# EasyEDA schematic Scematich PCB.json
TITLE: Sheet_1; REV: 1.0; Date: 2025-09-29; Sheet: 1/1; Drawn By: akunnw97; Company: Your Company
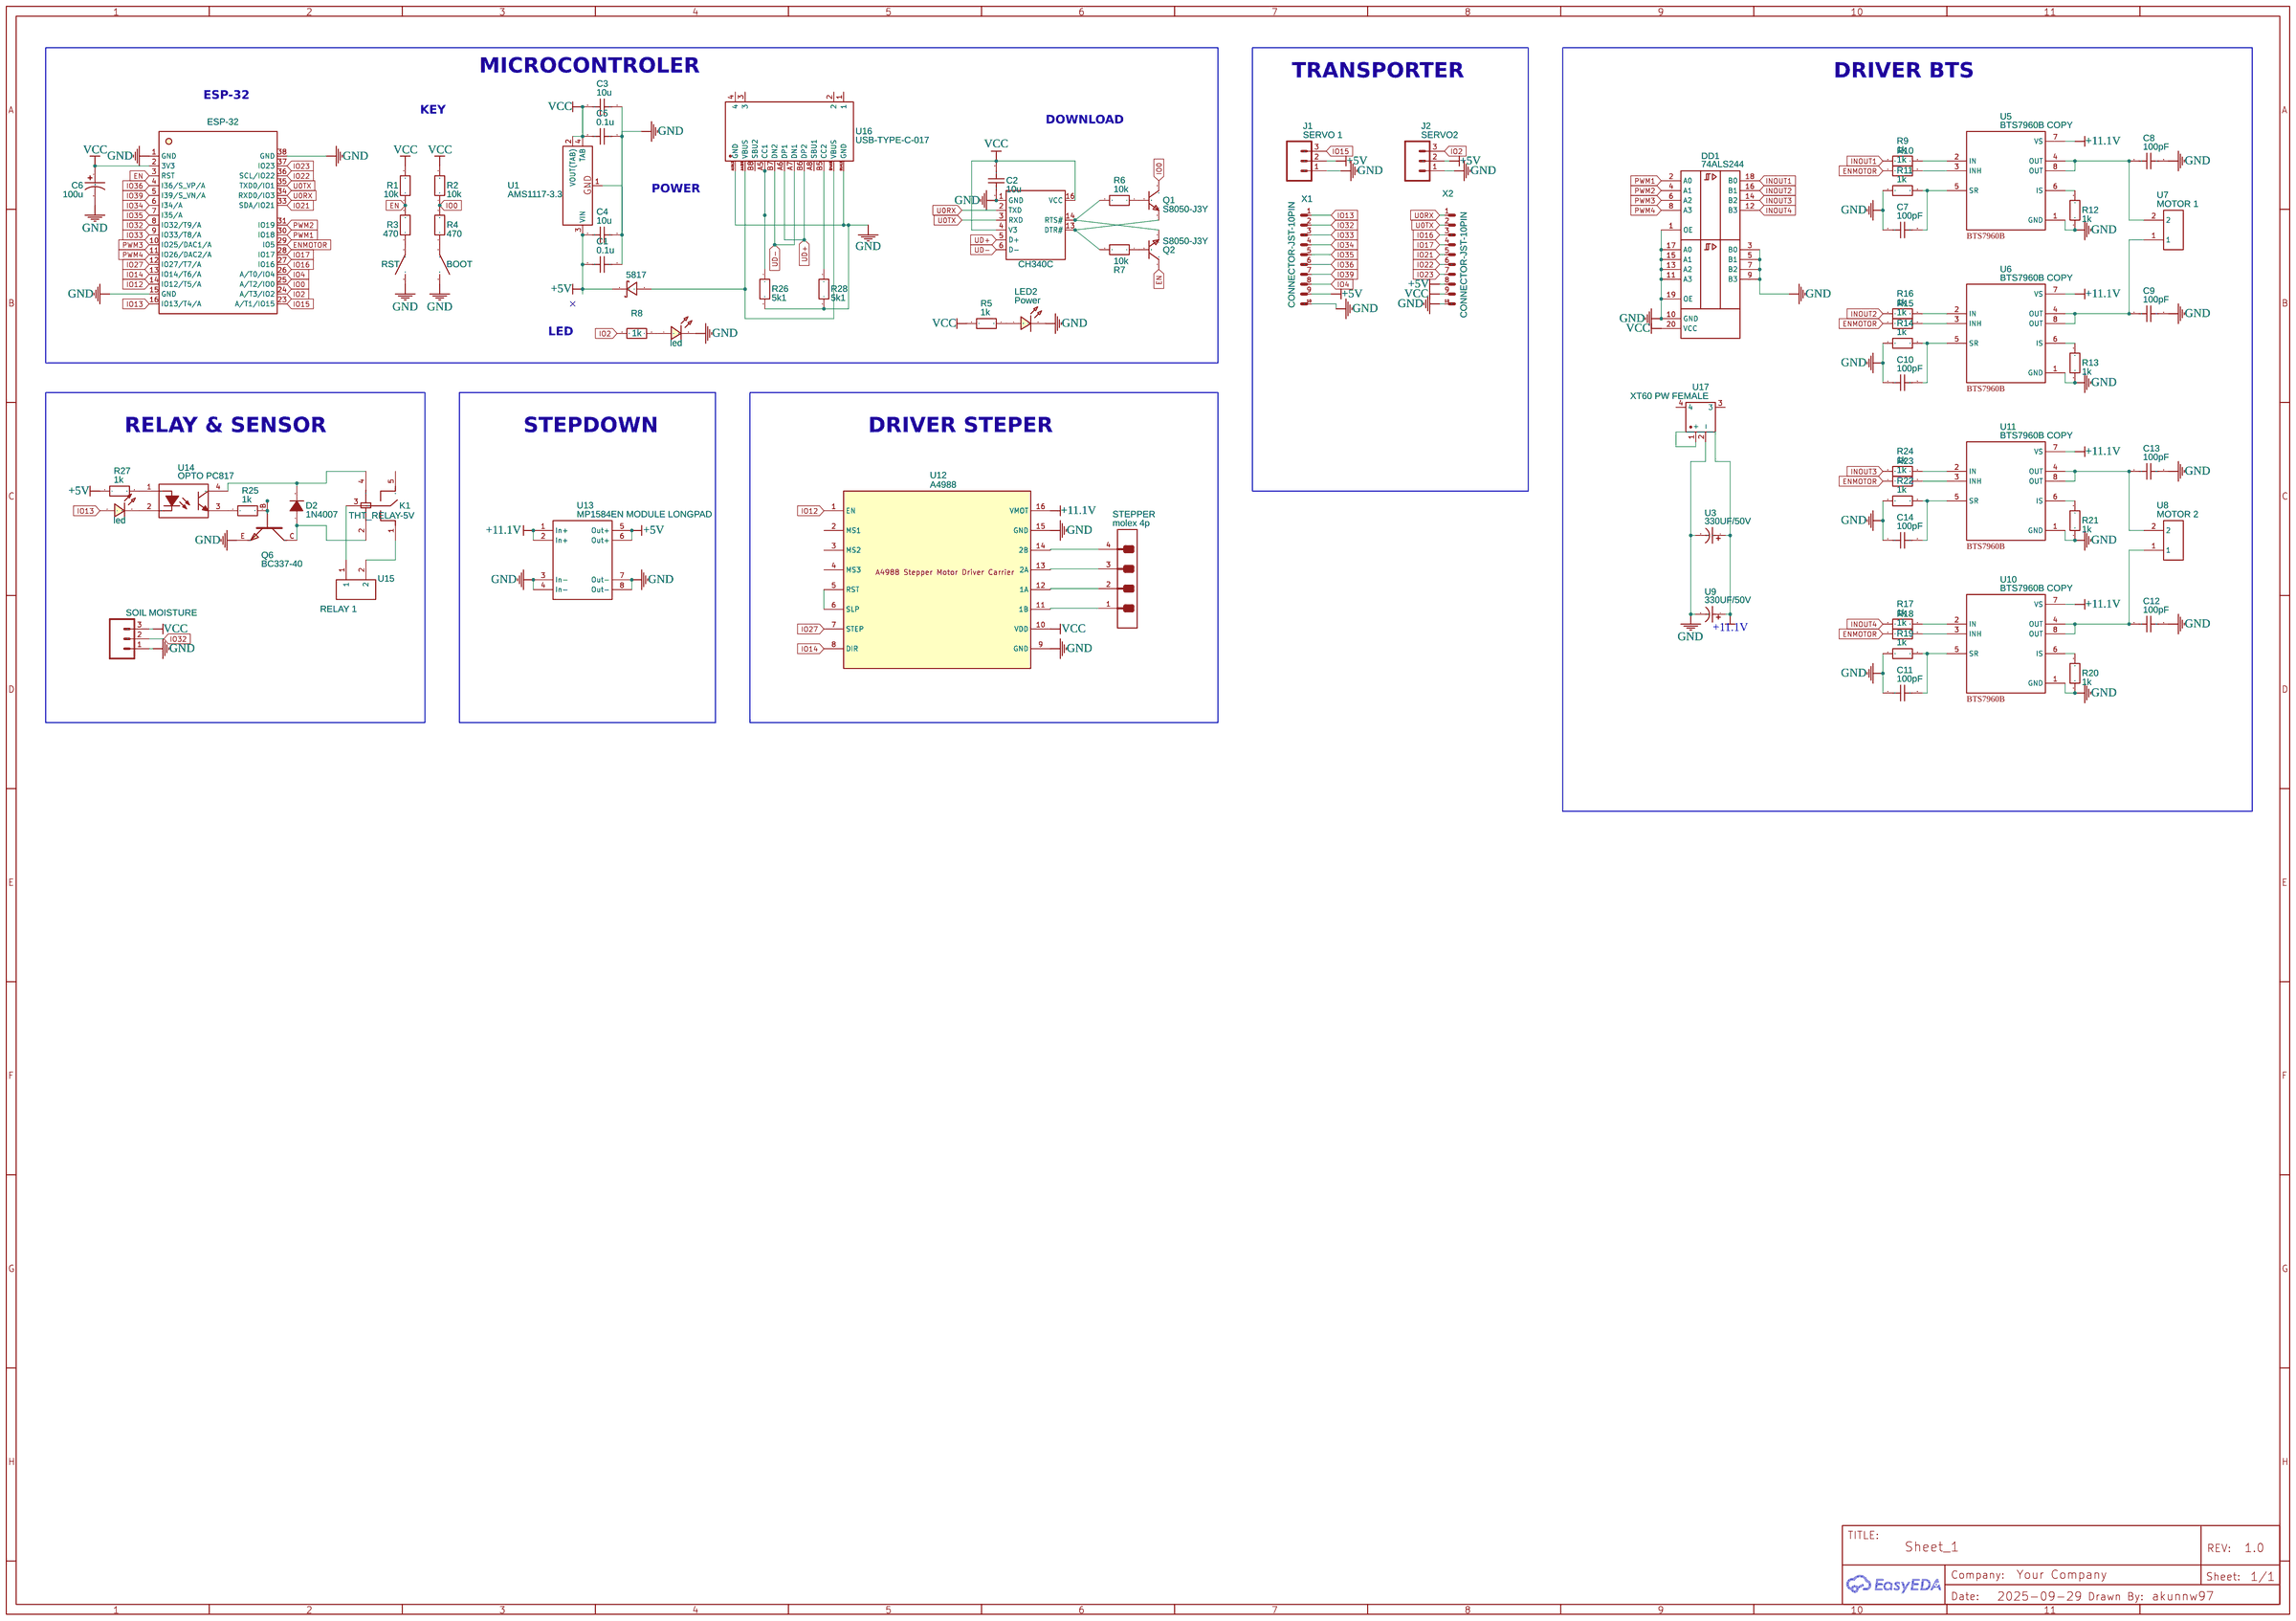
[diagram p0: schematic sheet]

## Parts
C1  0.1u  [C0805]
C2  10u  [C0805]
C3  10u  [C0805]
C4  10u  [C0805]
C5  0.1u  [C0805]
C6  100u  [CASE-B_3528]
C7  100pF  [C0805]
C8  100pF  [C0805]
C9  100pF  [C0805]
C10  100pF  [C0805]
C11  100pF  [C0805]
C12  100pF  [C0805]
C13  100pF  [C0805]
C14  100pF  [C0805]
D1  5817  [SOD-123F_L2.8-W1.8-LS3.7-RD]
D2  1N4007  [1N4007]
DD1  74ALS244  [SOIC-20_L13.0-W7.6-P1.27-LS10.3-BL]
J1  SERVO 1  [MOLEX-1X3]
J2  SERVO2  [MOLEX-1X3]
J4  SOIL MOISTURE  [MOLEX-1X3]
K1  THT_RELAY-5V  [RELAY-TH_RELAY-SPST]
LED1  led  [LED0805_RED]
LED2  Power  [LED0805_RED]
LED3  led  [LED0805_RED]
Q1  S8050-J3Y  [SOT-23-3_L3.0-W1.7-P0.95-LS2.9-BR]
Q2  S8050-J3Y  [SOT-23-3_L3.0-W1.7-P0.95-LS2.9-BR]
Q6  BC337-40  [BC337-40]
R1  10k  [R0805]
R2  10k  [R0805]
R3  470  [R0805]
R4  470  [R0805]
R5  1k  [R0805]
R6  10k  [R0805]
R7  10k  [R0805]
R8  1k  [R0805]
R9  1k  [R0805]
R10  1k  [R0805]
R11  1k  [R0805]
R12  1k  [R0805]
R13  1k  [R0805]
R14  1k  [R0805]
R15  1k  [R0805]
R16  1k  [R0805]
R17  1k  [R0805]
R18  1k  [R0805]
R19  1k  [R0805]
R20  1k  [R0805]
R21  1k  [R0805]
R22  1k  [R0805]
R23  1k  [R0805]
R24  1k  [R0805]
R25  1k  [R0805]
R26  5k1  [R0805]
R27  1k  [R0805]
R28  5k1  [R0805]
STEPPER  molex 4p  [MOLEX---47053-1000_MOLEX]
SW1  RST  [SW-SMD_L4.0-W2.9-LS5.0-A]
SW2  BOOT  [SW-SMD_L4.0-W2.9-LS5.0-A]
U1  AMS1117-3.3  [SOT-223_L6.7-W3.5-P2.30-BR]
U2  CH340C  [CH340C]
U3  330UF/50V  [330UF/50V]
U4  ESP-32  [ESP-32]
U5  BTS7960B COPY  [BTS7960B]
U6  BTS7960B COPY  [BTS7960B]
U7  MOTOR 1  [TERMINAL BLOK 2P]
U8  MOTOR 2  [TERMINAL BLOK 2P]
U9  330UF/50V  [330UF/50V]
U10  BTS7960B COPY  [BTS7960B]
U11  BTS7960B COPY  [BTS7960B]
U12  A4988  [A4988]
U13  MP1584EN MODULE LONGPAD  [MP1584EN-MODULE]
U14  OPTO PC817  [PC817B]
U15  RELAY 1  [TERMINAL BLOK 2P]
U16  USB-TYPE-C-017  [USB-TYPE-C-SMD_TYPE-C-SMT-16P]
U17  XT60 PW FEMALE  [XT60 PW FEMALE]
X1  CONNECTOR-JST-10PIN  [JST-XH-10PIN-LONG-PAD]
X2  CONNECTOR-JST-10PIN  [JST-XH-10PIN-LONG-PAD]

## Library data of the parts
C1-C5 C7-C14 = C_0603_US: Contributor: LCEDA_Lib
C6 = C_Tan_SMD_B_US: Contributor: LCEDA_Lib
D1 = 1N5819W: Supplier: LCSC; Supplier Part: C169540; Manufacturer: Shandong Jingdao Microelectronics; Contributor: LCSC; LCSC Assembly: Yes; SMT Type: Extend
D2 = 1N4007: Supplier: LCSC; Manufacturer: SEMTECH; Supplier Part: C106903; Contributor: inspireindia institute
DD1 = 74ALS244: Contributor: microdrv
J1 J2 J4 = CONN_03POLAR: Contributor: bartleph
K1 = THT_RELAY-SPST_5V: Supplier: LCSC; Supplier Part: C2941249; Manufacturer: null; Manufacturer Part: Relay-SPST; JLCPCB Part Class: Extended Part; Contributor: amiramsyar222
LED1-LED3 = LED-0603_R: Manufacturer: EVERLIGHT(台湾亿光); Manufacturer Part: 19-217/R6C-AL1M2VY/3T; Supplier Part: C72044; Supplier: LCSC; Contributor: LCEDA_01
Q1 Q2 = S8050-J3Y: Supplier: LCSC; Supplier Part: C364312; Manufacturer: (MDD) Jiangsu Yutai Elec; Contributor: LCSC; JLCPCB Part Class: Extended Part
Q6 = BC817-40: Contributor: gokulpriya
R1-R28 = R_0603_EU: Contributor: LCEDA_Lib
STEPPER = molex 4p: Contributor: delil1220
SW1 SW2 = 龟仔按键-带柱: Supplier: LCSC; Supplier Part: C354947; Manufacturer: BRIGHT; Manufacturer Part: TSA343G00D-250J2; Contributor: Fangbrbr
U1 = AMS1117-3.3: Supplier: LCSC; Supplier Part: C347222; Manufacturer: Youtai Semiconductor Co., Ltd.; Contributor: Fangbrbr; SMT Type: Extend; JLCPCB SMD: Yes
U2 = CH340C: Supplier: LCSC; Manufacturer: WCH; Supplier Part: C84681; Paste Type: recommend; Contributor: Fangbrbr
U3 U9 = 330UF/50V: Contributor: bangelektro123
U4 = 安信可ESP-32S: Supplier: LCSC; Supplier Part: C82899; Manufacturer: Ai-Thinker; Manufacturer Part: ESP-32S; Contributor: Fangbrbr
U5 U6 U10 U11 = BTS7960B COPY: Contributor: sakdnx
U7 U8 U15 = Terminal block 2p: Contributor: eril44
U12 = A4988: Contributor: ___________; sourceId: YsmgyP7pj
U13 = MP1584EN MODULE LONGPAD: Manufacturer Part: MP1584EN Module; Contributor: dardito2
U14 = PC817B: Contributor: xubaer
U16 = USB-TYPE-C-017: Supplier: LCSC; Supplier Part: C2927037; Manufacturer: DEALON(德艺隆); link: https://atta.szlcsc.com/upload/public/pdf/source/20211217/653222EE5174722C9DFE2966329956D8.pdf; JLCPCB Part Class: Extended Part; Contributor: icecycle
U17 = XT60 PW FEMALE: Manufacturer: Amass; Supplier: LCSC; Supplier Part: Amass; Contributor: s.shivr16
X1 X2 = CONNECTOR-JST-10PIN: Manufacturer: JST; Manufacturer Part: B2B-XH-AM(LF)(SN); Supplier: RS-Online; Supplier Part: 175-5596; Contributor: a20190798

## Nets
+5V: C1.2 C4.2 D1.1 J1.2 J2.2 R27.1 U1.3(VIN) U13.5(Out+) U13.6(Out+) X1.9 X2.8
+11.1V: U3.1 U5.7(VS) U6.7(VS) U9.1 U10.7(VS) U11.7(VS) U12.16(VMOT) U13.1(In+) U13.2(In+) U17.1(+)
GND: C1.1 C2.1 C3.1 C4.1 C5.1 C6.2 C7.1 C8.2 C9.2 C10.1 C11.1 C12.2 C13.2 C14.1 DD1.1(OE) DD1.3(B0) DD1.5(B1) DD1.7(B2) DD1.9(B3) DD1.10(GND) DD1.11(A3) DD1.13(A2) DD1.15(A1) DD1.17(A0) DD1.19(OE) J1.1 J2.1 J4.1 LED1.2 LED2.2 Q6.E R11.1 R12.1 R13.1 R14.1 R19.1 R20.1 R21.1 R22.1 R26.2 R28.2 SW1.2 SW2.2 U1.1(ADJ(GND)) U2.1(GND) U3.2 U4.1(GND) U4.15(GND) U4.38(GND) U5.1(GND) U6.1(GND) U9.2 U10.1(GND) U11.1(GND) U12.9(GND) U12.15(GND) U13.3(In-) U13.4(In-) U13.7(Out-) U13.8(Out-) U16.A1B12(GND) U16.B1A12(GND) U17.2(-) X1.10 X2.10
VCC: C2.2 C3.2 C5.2 C6.1 DD1.20(VCC) J4.3 R1.2 R2.2 R5.2 U1.2(VOUT(TAB)) U1.4(TAB) U2.4(V3) U2.16(VCC) U4.2(3V3) U12.10(VDD) X2.9
EN: Q2.3(C) R1.1 R3.2 U4.3(RST)
ENMOTOR: R10.1 R15.1 R18.1 R23.1 U4.29(IO5)
INOUT1: DD1.18(B0) R9.1
INOUT2: DD1.16(B1) R16.1
INOUT3: DD1.14(B2) R24.1
INOUT4: DD1.12(B3) R17.1
IO0: Q1.3(C) R2.1 R4.2 U4.25(A/T2/IO0)
IO2: J2.3 R8.2 U4.24(A/T3/IO2)
IO4: U4.26(A/T0/IO4) X1.8
IO12: U4.14(IO12/T5/A) U12.1(EN)
IO13: LED3.1 U4.16(IO13/T4/A) X1.1
IO14: U4.13(IO14/T6/A) U12.8(DIR)
IO15: J1.3 U4.23(A/T1/IO15)
IO16: U4.27(IO16) X2.3
IO17: U4.28(IO17) X2.4
IO21: U4.33(SDA/IO21) X2.5
IO22: U4.36(SCL/IO22) X2.6
IO23: U4.37(IO23) X2.7
IO27: U4.12(IO27/T7/A) U12.7(STEP)
IO32: J4.2 U4.8(IO32/T9/A) X1.2
IO33: U4.9(IO33/T8/A) X1.3
IO34: U4.6(I34/A) X1.4
IO35: U4.7(I35/A) X1.5
IO36: U4.4(I36/S_VP/A) X1.6
IO39: U4.5(I39/S_VN/A) X1.7
PWM1: DD1.2(A0) U4.30(IO18)
PWM2: DD1.4(A1) U4.31(IO19)
PWM3: DD1.6(A2) U4.10(IO25/DAC1/A)
PWM4: DD1.8(A3) U4.11(IO26/DAC2/A)
U0RX: U2.2(TXD) U4.34(RXD0/IO3) X2.1
U0TX: U2.3(RXD) U4.35(TXD0/IO1) X2.2
UD+: U2.5(D+) U16.A6(DP1) U16.B6(DP2)
UD-: U2.6(D-) U16.A7(DN1) U16.B7(DN2)
Net-(C7-2): C7.2 R11.2 U5.5(SR)
Net-(C8-1): C8.1 U5.4(OUT) U5.8(OUT) U7.2
Net-(C9-1): C9.1 U6.4(OUT) U6.8(OUT) U7.1
Net-(C10-2): C10.2 R14.2 U6.5(SR)
Net-(C11-2): C11.2 R19.2 U10.5(SR)
Net-(C12-1): C12.1 U8.1 U10.4(OUT) U10.8(OUT)
Net-(C13-1): C13.1 U8.2 U11.4(OUT) U11.8(OUT)
Net-(C14-2): C14.2 R22.2 U11.5(SR)
Net-(D1-2): D1.2 U16.A4B9(VBUS) U16.B4A9(VBUS)
Net-(D2-1): D2.1(A) K1.2 Q6.C
Net-(D2-2): D2.2(K) K1.4 U14.4(COL)
Net-(K1-1): K1.1 U15.2
Net-(K1-3): K1.3 U15.1
Net-(LED1-1): LED1.1 R8.1
Net-(LED2-1): LED2.1 R5.1
Net-(LED3-2): LED3.2 U14.2(CAT)
Net-(Q1-1): Q1.1(B) R6.1
Net-(Q1-2): Q1.2(E) R7.2 U2.13(DTR#)
Net-(Q2-1): Q2.1(B) R7.1
Net-(Q2-2): Q2.2(E) R6.2 U2.14(RTS#)
Net-(Q6-B): Q6.B R25.2
Net-(R3-1): R3.1 SW1.1
Net-(R4-1): R4.1 SW2.1
Net-(R9-2): R9.2 U5.2(IN)
Net-(R10-2): R10.2 U5.3(INH)
Net-(R12-2): R12.2 U5.6(IS)
Net-(R13-2): R13.2 U6.6(IS)
Net-(R15-2): R15.2 U6.3(INH)
Net-(R16-2): R16.2 U6.2(IN)
Net-(R17-2): R17.2 U10.2(IN)
Net-(R18-2): R18.2 U10.3(INH)
Net-(R20-2): R20.2 U10.6(IS)
Net-(R21-2): R21.2 U11.6(IS)
Net-(R23-2): R23.2 U11.3(INH)
Net-(R24-2): R24.2 U11.2(IN)
Net-(R25-1): R25.1 U14.3(EM)
Net-(R26-1): R26.1 U16.A5(CC1)
Net-(R27-2): R27.2 U14.1(AN)
Net-(R28-1): R28.1 U16.B5(CC2)
Net-(STEPPER-1): STEPPER.1 U12.11(1B)
Net-(STEPPER-2): STEPPER.2 U12.12(1A)
Net-(STEPPER-3): STEPPER.3 U12.13(2A)
Net-(STEPPER-4): STEPPER.4 U12.14(2B)
Net-(U12-5): U12.5(RST) U12.6(SLP)

Not connected (* = marked no-connect by the designer): K1 5; U12 2(MS1) 3(MS2) 4(MS3); U16 1 2 3 4 A8(SBU1) B8(SBU2); U17 3 4

## Notes on the sheet
- MICROCONTROLER
- TRANSPORTER
- DRIVER BTS
- ESP-32
- KEY
- DOWNLOAD
- POWER
- LED
- RELAY & SENSOR
- STEPDOWN
- DRIVER STEPER
